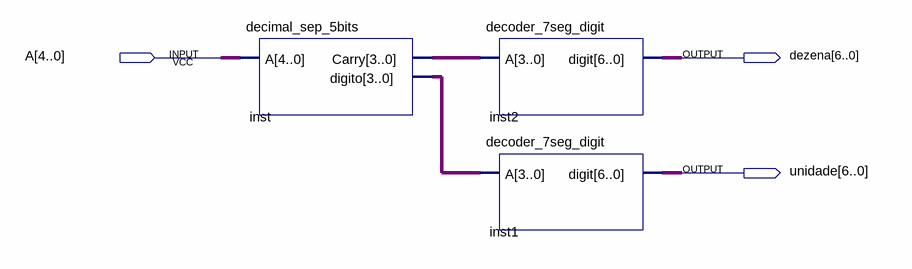
[diagram p0: schematic sheet]
// Quartus schematic decoder_7seg.bdf as structural Verilog: 3 symbols, 3 pins
module decoder_7seg (
  input  [4:0] A,
  output [6:0] dezena,
  output [6:0] unidade
);

  wire [3:0] inst_carry, inst_digito;

  decimal_sep_5bits inst (.A(A), .Carry(inst_carry), .digito(inst_digito));
  decoder_7seg_digit inst2 (.A(inst_carry), .digit(dezena));
  decoder_7seg_digit inst1 (.A(inst_digito), .digit(unidade));
endmodule
